# EAGLE design wifi temperature (EAGLE 8.4.1)
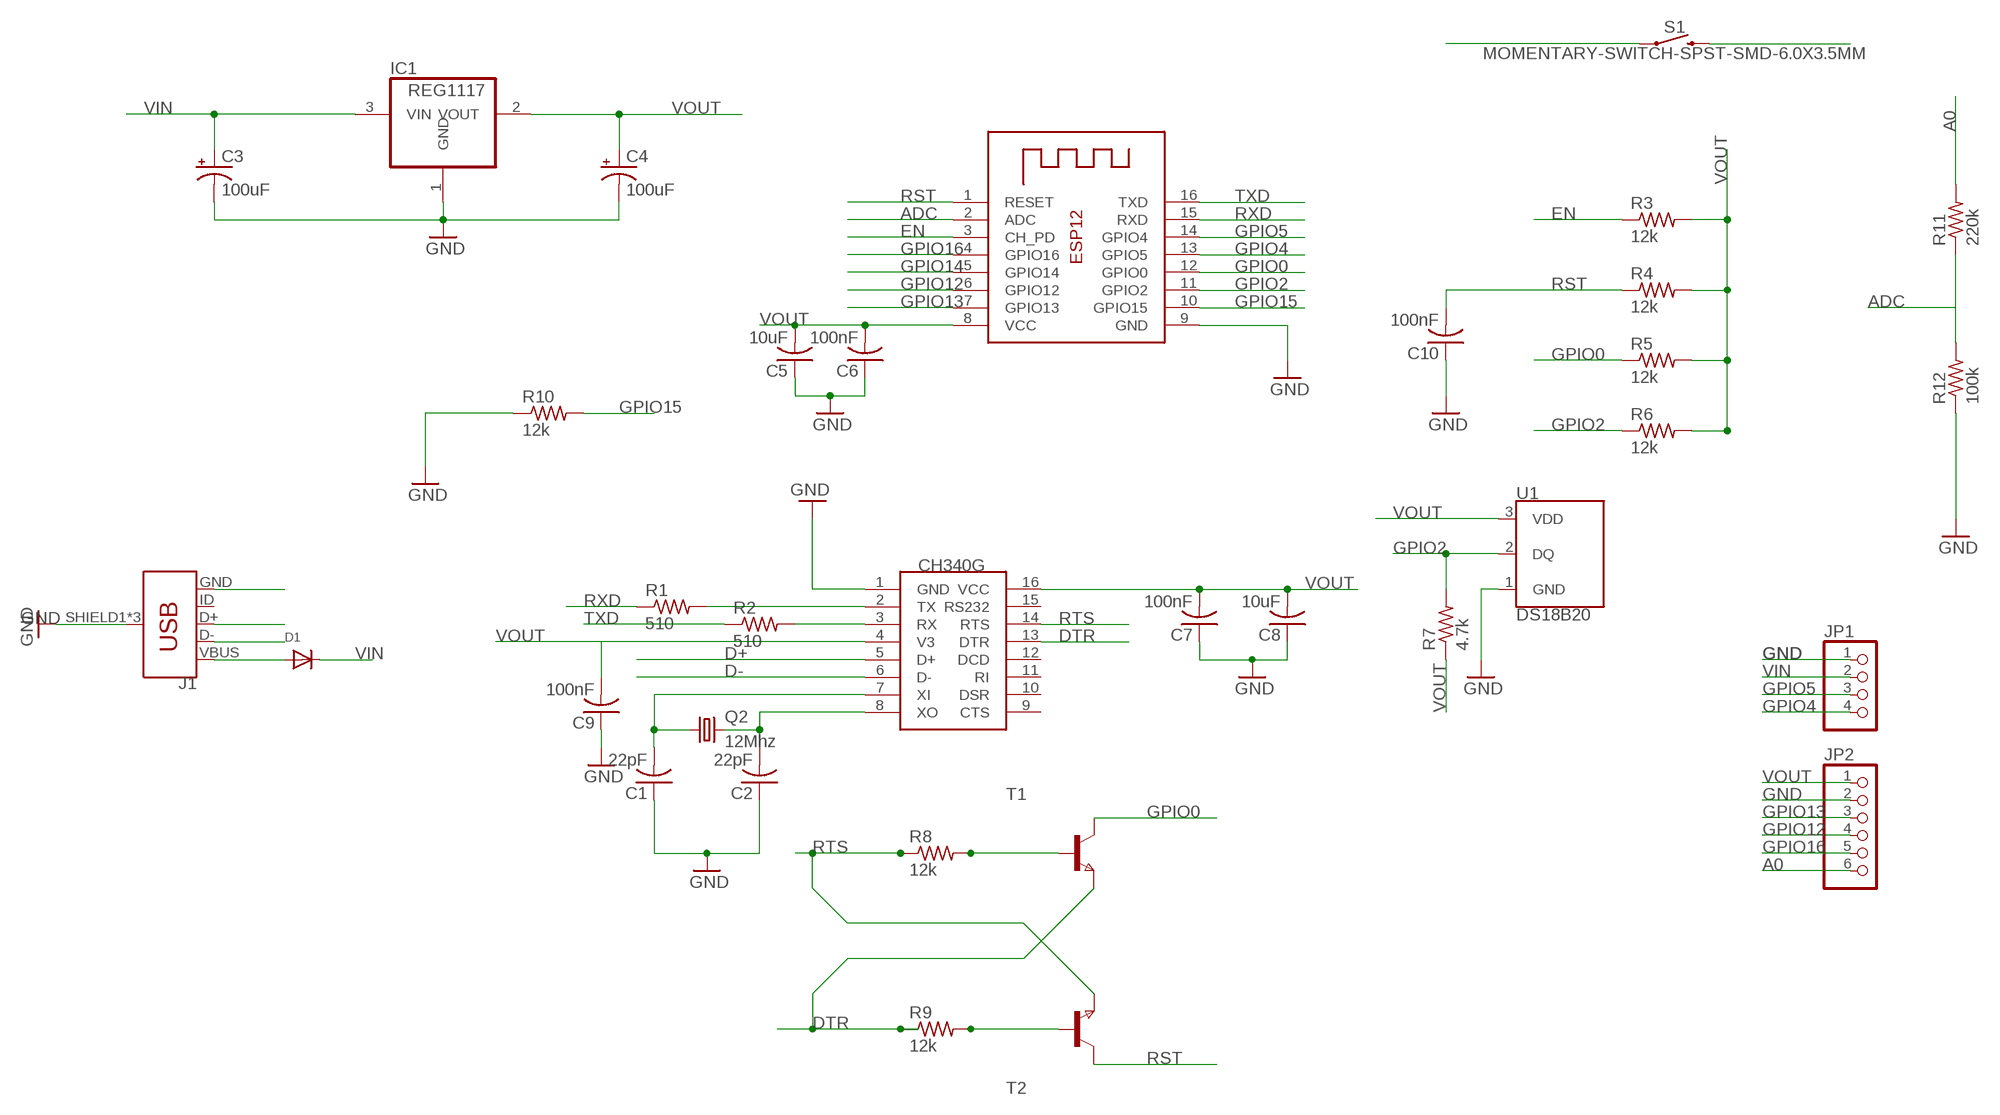
[diagram p0: schematic, sheet 1]

## Parts
C1  22pF  C-USC0805  [C0805]
C2  22pF  C-USC0805  [C0805]
C3  100uF  CPOL-USCT7343  [CT7343]
C4  100uF  CPOL-USCT7343  [CT7343]
C5  10uF  C-USC0805  [C0805]
C6  100nF  C-USC0805  [C0805]
C7  100nF  C-USC0805  [C0805]
C8  10uF  C-USC0805  [C0805]
C9  100nF  C-USC0805  [C0805]
C10  100nF  C-USC0805  [C0805]
D1  DIODESOD-123  [SOD-123]
IC1  REG1117  [SOT223]
J1  USB_MICRO-BREDUCED_PASTE  [USB-B-MICRO-SMD_RED_PASTE]
JP1  PINHD-1X4  [1X04]
JP2  PINHD-1X6  [1X06]
Q2  12Mhz  CRYSTALHC49S  [HC49/S]
R1  510  R-US_R0805  [R0805]
R2  510  R-US_R0805  [R0805]
R3  12k  R-US_R0805  [R0805]
R4  12k  R-US_R0805  [R0805]
R5  12k  R-US_R0805  [R0805]
R6  12k  R-US_R0805  [R0805]
R7  4.7k  R-US_R0805  [R0805]
R8  12k  R-US_R0805  [R0805]
R9  12k  R-US_R0805  [R0805]
R10  12k  R-US_R0805  [R0805]
R11  220k  R-US_R0805  [R0805]
R12  100k  R-US_R0805  [R0805]
S1  MOMENTARY-SWITCH-SPST-SMD-6.0X3.5MM  [TACTILE_SWITCH_SMD_6.0X3.5MM]
T1  NPNSOT23  [SOT-23]
T2  NPNSOT23  [SOT-23]
U1  DS18B20  [TO-92-AMMO]
U$1  CH340G  [SOIC16]
X1  ESP-12  [ESP-12]

## Nets
A0: JP2.6 R11.2
ADC: R11.1 R12.2 X1.2(ADC)
D+: J1.D+ U$1.5(D+)
D-: J1.D- U$1.6(D-)
DTR: R9.1 T1.2(E) U$1.13(DTR)
EN: R3.1 X1.3(CH_PD)
GND: C1.1 C2.1 C3.- C4.- C5.1 C6.1 C7.1 C8.1 C9.1 C10.1 IC1.1(GND) J1.GND JP1.1 JP2.2 R10.1 R12.1 S1.2 U1.1(GND) U$1.1(GND) X1.9(GND)
GPIO0: R5.1 T1.1(C) X1.12(GPIO0)
GPIO2: R6.1 R7.2 U1.2(DQ) X1.11(GPIO2)
GPIO4: JP1.4 X1.13(GPIO5)
GPIO5: JP1.3 X1.14(GPIO4)
GPIO12: JP2.4 X1.6(GPIO12)
GPIO13: JP2.3 X1.7(GPIO13)
GPIO14: X1.5(GPIO14)
GPIO15: R10.2 X1.10(GPIO15)
GPIO16: JP2.5 X1.4(GPIO16)
N$1: C1.2 Q2.1 U$1.7(XI)
N$2: C2.2 Q2.2 U$1.8(XO)
N$3: R8.2 T1.3(B)
N$4: R9.2 T2.3(B)
N$5: R1.2 U$1.2(TX)
N$6: R2.2 U$1.3(RX)
N$8: D1.A J1.VBUS
RST: C10.2 R4.1 S1.1 T2.1(C) X1.1(RESET)
RTS: R8.1 T2.2(E) U$1.14(RTS)
RXD: R1.1 X1.15(RXD)
TXD: R2.1 X1.16(TXD)
VIN: C3.+ D1.C IC1.3(VIN) JP1.2
VOUT: C4.+ C5.2 C6.2 C7.2 C8.2 C9.2 IC1.2(VOUT) JP2.1 R3.2 R4.2 R5.2 R6.2 R7.1 U1.3(VDD) U$1.4(V3) U$1.16(VCC) X1.8(VCC)
Unconnected: J1.ID J1.SHIELD1(SHIELD) J1.SHIELD2(SHIELD) J1.SHIELD3(SHIELD) U$1.9(CTS) U$1.10(DSR) U$1.11(RI) U$1.12(DCD) U$1.15(RS232)

## Library data of the parts
C1 C2 C5-C10 = adafruit:C-US: CAPACITOR, American symbol
C3 C4 = adafruit:CPOL-US: POLARIZED CAPACITOR, American symbol
D1 = adafruit:DIODE: Diode SMADIODE - SMA Surface Mount Package 20V 1A Schottky Diode Digikey: 641-1014-6-ND DO-1N4148 - Through Hole Small Current Diode SOD-123 20V 1 A (.5mV Vf) Schottky Diode - Digikey: MBRX120TPMSCT-ND SOD-323 10V 570mA (.38mV Vf, 3ns) Schottky Diode - Digikey: ZLLS410CT-ND SOD-523 30V 30mA Schottky Diode (RB751S-40TE61) - Digikey: RB751S-40TE61CT-ND SOT23-R/W - SOT23 Package (R = Solder Paste/Reflow Ovens, W = Hand-Soldering) BAT54Film 40V 300mA - Digikey: 497-7162-1-ND
IC1 = burr-brown:REG1117: 800mA and 1A Low Dropout (LDO) Positive Regulator 1.8V, 2.5V, 2.85V, 3.3V, 5V, and Adj; MPN: REG1117; OC_FARNELL: 1097566; OC_NEWARK: 14P6981
J1 = SparkFun-Connectors:USB_MICRO-B: USB Type Micro-B Connector Male/female and PTH/SMT variants SparkFun Products: SparkFun microB USB Breakout <https://www.sparkfun.com/products/12035> SparkFun USB microB Plug Breakout <https://www.sparkfun.com/products/10031> SparkFun ESP8266 Thing <https://www.sparkfun.com/products/13231>; PROD_ID: CONN-11752
JP1 = pinhead:PINHD-1X4: PIN HEADER
JP2 = adafruit:PINHD-1X6: PIN HEADER
Q2 = adafruit:CRYSTAL: CRYSTAL; OC_FARNELL: 1667008; OC_NEWARK: unknown
R1-R12 = adafruit:R-US_: RESISTOR, American symbol
S1 = SparkFun-Switches:MOMENTARY-SWITCH-SPST: Momentary Switch (Pushbutton) - SPST Normally-open (NO) SPST momentary switches (buttons, pushbuttons). Variants PTH-12MM - 12mm square, through-hole Momentary Pushbutton Switch - 12mm Square <https://www.sparkfun.com/products/9190> (COM-09190) PTH-6.0MM, PTH-6.0MM-KIT - 6.0mm square, through-hole Mini Pushbutton Switch <https://www.sparkfun.com/products/97> (COM-00097) KIT package intended for soldering kit's - only one side of pads' copper is exposed. PTH-RIGHT-ANGLE-KIT - Right-angle, through-hole Right Angle Tactile Button <https://www.sparkfun.com/products/10791> - Used on SparkFun BigTime Watch Kit <https://www.sparkfun.com/products/11734> SMD-12MM - 12mm square, surface-mount Tactile Button - SMD (12mm) <https://www.sparkfun.com/products/12993> (COM-12993) Used on SparkFun PicoBoard <https://www.sparkfun.com/products/11888> SMD-4.5MM - 4.5mm Square Trackball Switch Used on SparkFun Blackberry Trackballer Breakout <https://www.sparkfun.com/products/13169> SMD-4.6MMX2.8MM - 4.60mm x 2.80mm, surface mount Used on SparkFun SAMD21 Mini Breakout <https://www.sparkfun.com/products/13664> SMD-5.2MM, SMD-5.2-REDUNDANT - 5.2mm square, surface-mount Mini Pushbutton Switch - SMD <https://www.sparkfun.com/products/8720> (COM-08720) Used on Arduino Pro Mini <https://www.sparkfun.com/products/11114> REDUNDANT package connects both switch circuits together SMD-6.0X3.5MM - 6.0 x 3.5mm, surface mount Momentary Reset Switch SMD <https://www.sparkfun.com/products/8229> (COM-08229) SMD-6.2MM-TALL - 6.2mm square, surface mount Tactile Button - SMD (6mm) <https://www.sparkfun.com/products/12992> Used on SparkFun Digital Sandbox <https://www.sparkfun.com/products/12651> SMD-RIGHT-ANGLE - Right-angle, surface mount Used on SparkFun Block for Intel® Edison - Arduino <https://www.sparkfun.com/products/13036>; PROD_ID: SWCH-00815; SF_SKU: COM-08229
T1 T2 = zetex:NPNSOT23: NPN TRANSISTOR; MPN: DSS20201L-7; OC_FARNELL: 1710688; OC_NEWARK: 25R4555
U1 = SparkFun-Sensors:DS18B20: Dallas/Maxim DS18B20 1-Wire Temperature Sensor The DS18B20 reports degrees C with 9 to 12-bit precision, -55C to 125C (+/-0.5C). Each sensor has a unique 64-Bit Serial number etched into it - allows for a huge number of sensors to be used on one data bus. Datasheet <http://datasheets.maximintegrated.com/en/ds/DS18B20.pdf> SparkFun Products One Wire Digital Temperature Sensor - DS18B20 <https://www.sparkfun.com/products/245> (SEN-00245); STORE_ID: SEN-00245
U$1 = ch340g:CH340G
X1 = adafruit:ESP-12

## Board
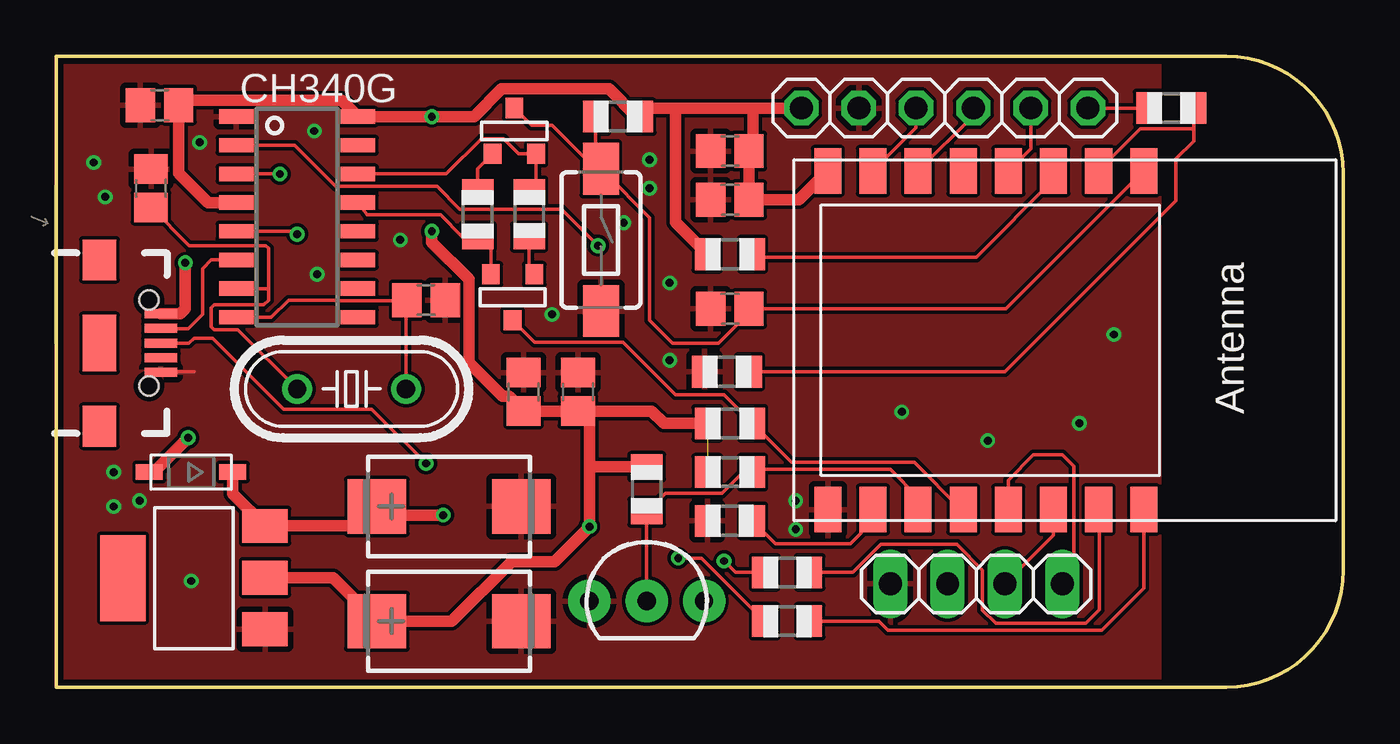
[diagram p1: board, top side]
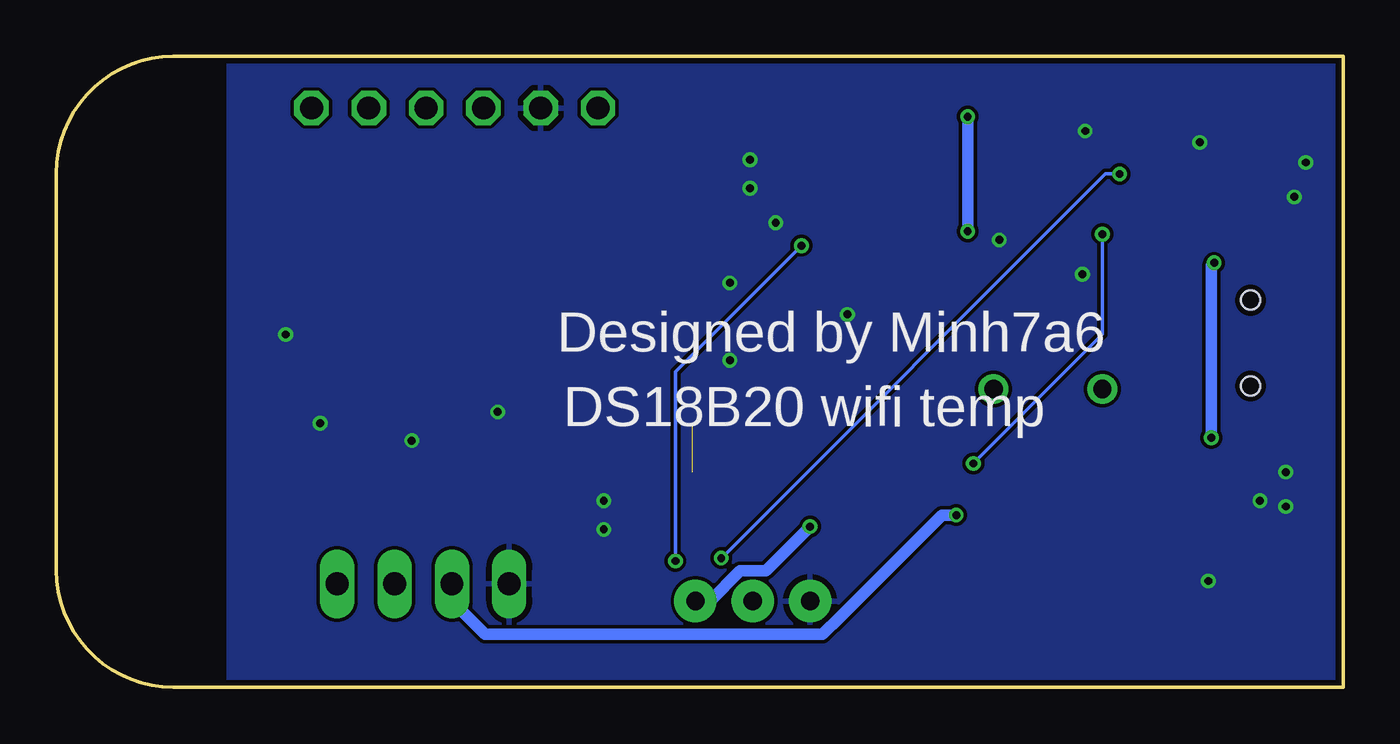
[diagram p2: board, bottom side, seen from below]

Size 57.02 x 27.94 mm. Coordinates in mm from the lower left corner, seen from the top.
Outline: 0,0 0,27.94 51.85,27.94 arc-90 57.02,22.77 57.02,5.17 arc-90 51.85,0 0,0
Copper layers (1*16): Top 0.035mm / dielectric 1.5mm / Bottom 0.035mm
Design rules "SeeedStudio_2layer_DRU_no_angle_20140221": minimum track width 6mil, minimum drill 12mil, track to track 6mil, track to pad 6mil, pad to pad 6mil, via to via 6mil, smd to smd 0mil, copper to edge 10mil, drill to drill 10mil, minimum pad ring 10mil, minimum via ring 6mil, stop-mask expansion 2mil, vias tented up to drill 100mil, thermal gap 10mil

### Footprints (pad centres in the part's own frame; a part is rotated, then mirrored left to right if it is on the bottom)
C0805 = smd 1.3 x 1.5: 1 -0.85,0; 2 0.85,0
CT7343 = smd 2.6 x 2.4: + 3.2,0; - -3.2,0
SOD-123 = smd 1.2 x 0.7: A 1.85,0; C -1.85,0
SOT223 = smd 1.499 x 2.007: 1 -2.261,-3.15; 2 0.025,-3.15; 3 2.311,-3.15 | smd 3.81 x 2.007: 4 0,3.15
USB-B-MICRO-SMD_RED_PASTE = smd 1.45 x 0.4: D+ 2.725,0; D- 2.725,0.65; GND 2.725,-1.3; ID 2.725,-0.65; VBUS 2.725,1.3 | smd 1.5 x 1.8: SHIELD1 0,3.685; SHIELD2 0,-3.685 | smd 1.5 x 2.5: SHIELD3 0,0 | hole 0.85: 2.2,1.9; 2.2,-1.9
1X04 = drill 1.016 long: 1 -3.81,0; 2 -1.27,0; 3 1.27,0; 4 3.81,0
1X06 = drill 1.016 octagon: 1 -6.35,0; 2 -3.81,0; 3 -1.27,0; 4 1.27,0; 5 3.81,0; 6 6.35,0
HC49/S = drill 0.813: 1 -2.413,0; 2 2.413,0
R0805 = smd 1.1 x 1.4: 1 -1,0; 2 1,0
TACTILE_SWITCH_SMD_6.0X3.5MM = smd 2.3 x 1.6: 1 -3.15,0; 2 3.15,0
SOT-23 = smd 0.787 x 0.889: 1 0.025,-1.016; 2 -0.94,1.016; 3 0.991,1.016
TO-92-AMMO = drill 0.813 pad 1.88: 1 -2.54,0; 2 0,0; 3 2.54,0
SOIC16 = smd 0.635 x 1.524: 1 -4.445,-2.695; 2 -3.175,-2.695; 3 -1.905,-2.695; 4 -0.635,-2.695; 5 0.635,-2.695; 6 1.905,-2.695; 7 3.175,-2.695; 8 4.445,-2.695; 9 4.445,2.695; 10 3.175,2.695; 11 1.905,2.695; 12 0.635,2.695; 13 -0.635,2.695; 14 -1.905,2.695; 15 -3.175,2.695; 16 -4.445,2.695
ESP-12 = smd 2 x 1.2: 1 -7.5,4.5; 2 -7.5,2.5; 3 -7.5,0.5; 4 -7.5,-1.5; 5 -7.5,-3.5; 6 -7.5,-5.5; 7 -7.5,-7.5; 8 -7.5,-9.5; 9 7.5,-9.5; 10 7.5,-7.5; 11 7.5,-5.5; 12 7.5,-3.5; 13 7.5,-1.5; 14 7.5,0.5; 15 7.5,2.5; 16 7.5,4.5

### Placement (x,y rotation side)
C1  4.19,22.1 270 top
C2  16.38,17.14 180 top
C3  17.4,8 180 top
C4  17.4,2.92 180 top
C5  20.7,13.08 270 top
C6  29.85,21.59 0 top
C7  23.11,13.08 270 top
C8  29.85,23.75 0 top
C9  4.57,25.78 0 top
C10  29.85,16.76 0 top
D1  5.97,9.53 180 top
IC1  6.1,4.83 90 top
J1  1.91,15.24 0 top
JP1  40.77,4.57 0 top
JP2  39.37,25.65 0 top
Q2  13.08,13.21 0 top
R1  32.38,5.08 180 top
R2  32.38,2.92 180 top
R3  29.85,19.18 180 top
R4  24.89,25.27 0 top
R5  29.85,11.68 180 top
R6  29.85,9.53 180 top
R7  26.16,8.76 270 top
R8  20.96,20.95 270 top
R9  18.67,20.95 90 top
R10  29.85,7.37 0 top
R11  49.4,25.65 180 top
R12  29.72,13.97 0 top
S1  24.13,19.81 270 top
T1  20.19,17.27 0 top
T2  20.32,24.64 180 top
U1  26.16,3.81 0 top
U$1  10.67,20.83 270 top
X1  43.69,15.37 270 top

### Tracks (layer width: path | path; a pad name or v marks a point on that pad's centre or on a via)
A0
  Top 0.152: JP2.6 R11.2
ADC
  Top 0.152: X1.2 48.05,24.72 50.32,24.72 50.4,24.64 | 49.98,25.65 R11.1 50.4,24.64 | R12.2 42.04,13.97 49.61,21.54 49.61,23.4 50.4,24.19 50.4,24.64
D+  (via drill 0.35)
  Top 0.152: J1.D+ 5.87,15.24 6.1,15.47 6.93,15.47 10.08,12.32 13.97,12.32 v16.38,9.91 | v10.67,20.07 10.54,20.19 U$1.5
  Bottom 0.152: v16.38,9.91 10.67,15.62 v10.67,20.07
D-
  Top 0.152: U$1.6 6.86,18.92 6.48,18.54 6.48,16.51 5.84,15.88 5.21,15.88 | 5.21,15.88 4.99,15.88 | J1.D- 5.19,15.89 5.21,15.88
DTR
  Top 0.152: T1.2 19.25,19.37 R9.1 17.99,19.95 17.02,20.93 13.77,20.93 U$1.13
EN
  Top 0.152: X1.3 44.19,22.47 40.77,19.05 30.97,19.05 R3.1
GND  (via drill 0.35)
  Top 0.152: J1.GND 4.66,13.97 6.1,13.97
  other vias: 41.27,10.92 37.46,12.19 45.34,11.68 46.86,15.62 27.18,14.48 27.18,17.91 26.29,22.1 26.29,23.37 25.15,20.57 21.97,16.51 15.24,19.81 11.56,18.29 11.43,24.64 6.35,24.13 2.54,9.53 2.54,8 3.68,8.25 5.97,4.7 32.77,8.25 32.77,6.99 1.65,23.24 2.16,21.72
  pour Bottom: -4.45,31.5 -4.45,-1.52 49.4,-1.52 49.4,31.5
  pour Top: -1.91,30.48 48.89,30.48 48.89,0 -3.17,0 -3.17,30.48
GPIO0
  Top 0.152: T1.1 21.2,15.28 25.11,15.28 27.43,12.95 29.58,12.95 R5.1 32.57,9.96 38.02,9.96 40.11,7.87 X1.12
GPIO2
  Top 0.152: R6.1 30.42,9.53 29.49,8.6 27,8.6 R7.2 U1.2 | R6.1 31.23,9.91 | R6.1 30.97,9.65 36.96,9.65 38.19,8.42 X1.11
GPIO4
  Top 0.152: 42.04,7.72 X1.13 42.19,9.17 43.31,10.29 44.58,10.29 45.09,9.78 45.09,5.08 JP1.4
GPIO5
  Top 0.152: 44.58,7.48 X1.14 44.19,6.72 JP1.3
GPIO12
  Top 0.152: X1.6 40.64,25.32 JP2.4
GPIO13
  Top 0.152: X1.7 38.1,24.78 JP2.3
GPIO15
  Top 0.152: X1.10 36.19,7.36 35.18,6.35 31.86,6.35 R10.2
GPIO16
  Top 0.152: X1.4 43.18,23.86 JP2.5
N$1
  Top 0.152: C1.2 5.88,19.56 9.27,19.56 9.4,19.43 9.4,17.65 | 7.62,17.65 U$1.7 9.4,17.65 | Q2.1 8.04,15.84 6.99,15.84 6.85,15.97 6.85,16.8 6.99,16.93 9.18,16.93 9.4,17.14 9.4,17.65
N$2
  Top 0.152: 15.49,17.02 15.49,17.11 C2.2 | 15.49,17.02 Q2.2 | U$1.8 9.53,16.38 10.29,17.14 12.34,17.14 12.38,17.11 15.4,17.11 15.49,17.02
N$3
  Top 0.152: T1.3 20.96,18.52 R8.2
N$4
  Top 0.152: T2.3 18.67,22.96 R9.2
N$5  (via drill 0.35)
  Top 0.152: v24,19.56 22.39,21.18 17.87,21.18 16.86,22.19 12.38,22.19 10.56,24 U$1.2 | v29.59,5.59 30.1,5.08 R1.2
  Bottom 0.152: v24,19.56 29.59,13.97 v29.59,5.59
N$6  (via drill 0.35)
  Top 0.152: R2.2 28.59,5.71 v27.56,5.71 | v9.91,22.73 U$1.3
  Bottom 0.152: v27.56,5.71 10.54,22.73 v9.91,22.73
N$8  (via drill 0.35)
  Top 0.508: v5.84,11.05 4.32,9.53 D1.A | J1.VBUS 5.49,16.54 5.71,16.76 v5.71,18.8
  Bottom 0.508: v5.71,18.8 5.84,18.67 v5.84,11.05
RST
  Top 0.152: T2.1 21.06,24.89 21.97,24.89 23.9,22.96 S1.1 24.31,22.78 | 30.86,16.76 C10.2 | 30.86,16.76 42.09,16.76 X1.1 | 24.31,22.78 26.29,20.8 26.29,18.29 26.29,18.16 26.29,16.26 27.31,15.24 29.34,15.24 30.86,16.76 | R4.1 23.89,23.2 24.31,22.78
RTS
  Top 0.152: R8.1 21.26,22.26 T2.2 20.49,23.62 19.82,24.29 18.84,24.29 17.28,22.73 U$1.14
RXD
  Top 0.152: R1.1 35.3,5.08 36.55,6.33 39.91,6.33 41.05,5.19 41.05,3.4 41.63,2.82 45.62,2.82 46.23,3.43 46.23,7.83 X1.15
TXD
  Top 0.152: R2.1 36.45,2.92 36.85,2.52 46.33,2.52 48.19,4.37 X1.16
VIN  (via drill 0.35)
  Top 0.508: 13.79,8.41 C3.+ 14.58,7.62 | 14.58,7.62 v17.15,7.62 | D1.C 7.82,8.56 IC1.3 14.1,7.14 14.58,7.62
  Bottom 0.508: v17.15,7.62 17.78,7.62 22.28,3.12 23.06,2.34 38.02,2.34 39.5,3.81 JP1.2
VOUT  (via drill 0.35)  (1 unrouted)
  Top 0.508: 23.62,9.65 v23.62,7.11 22.07,5.56 20.16,5.56 17.52,2.92 C4.+ 12.27,4.85 IC1.2 | 23.62,9.65 23.62,11.72 C7.2 | C7.2 C5.2 20.06,12.88 19.78,12.88 18.29,14.37 18.29,18.06 16.64,19.72 v16.64,20.19 | 30.31,21.97 C6.2 | C6.2 32.91,21.59 X1.8 | C7.2 26.38,12.23 26.92,11.68 R5.2 | 27.43,25.65 30.86,25.65 | 27.43,25.65 26.27,25.65 R4.2 25.72,25.27 24.49,26.5 19.73,26.5 18.5,25.27 v16.64,25.27 U$1.16 12.64,26 5.64,26 C9.2 5.42,22.77 6.73,21.46 U$1.4 | 30.86,25.65 JP2.1 | 30.86,25.65 30.86,23.91 C8.2 C6.2 | R3.2 27.43,20.59 27.43,25.65 | R7.1 23.73,9.76 23.62,9.65
  Bottom 0.508: v16.64,20.19 v16.64,25.27 | U1.3 28.07,3.81 26.72,5.16 25.58,5.16 v23.62,7.11

### Text on the board
bPlace: Designed by Minh7a6 | DS18B20 wifi temp